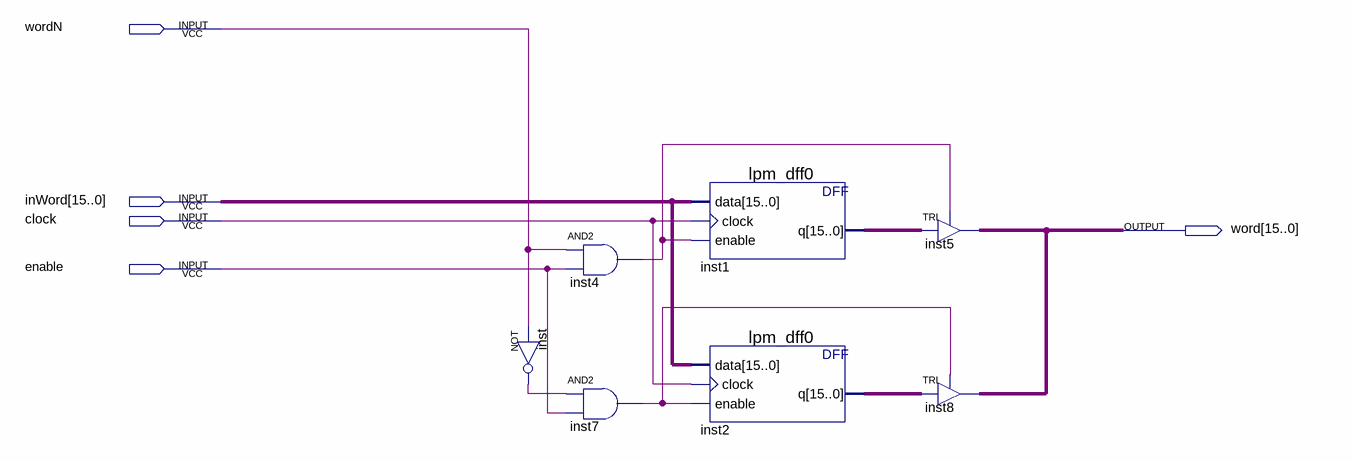
[diagram p0: schematic sheet]
// Quartus schematic KStringBlock.bdf as structural Verilog: 7 symbols, 5 pins
module KStringBlock (
  input  wordN,
  input  [15:0] inWord,
  input  clock,
  input  enable,
  output [15:0] word
);

  wire inst4_out, inst7_out, inst_out;
  wire [15:0] inst1_q, inst2_q;

  not inst (inst_out, wordN);
  and inst4 (inst4_out, wordN, enable);
  and inst7 (inst7_out, inst_out, enable);
  lpm_dff0 inst1 (.data(inWord), .clock(clock), .enable(inst4_out), .q(inst1_q));
  lpm_dff0 inst2 (.data(inWord), .clock(clock), .enable(inst7_out), .q(inst2_q));
  TRI inst5[15:0] (.IN(inst1_q), .OE(inst4_out), .OUT(word));
  TRI inst8[15:0] (.IN(inst2_q), .OE(inst7_out), .OUT(word));
endmodule
